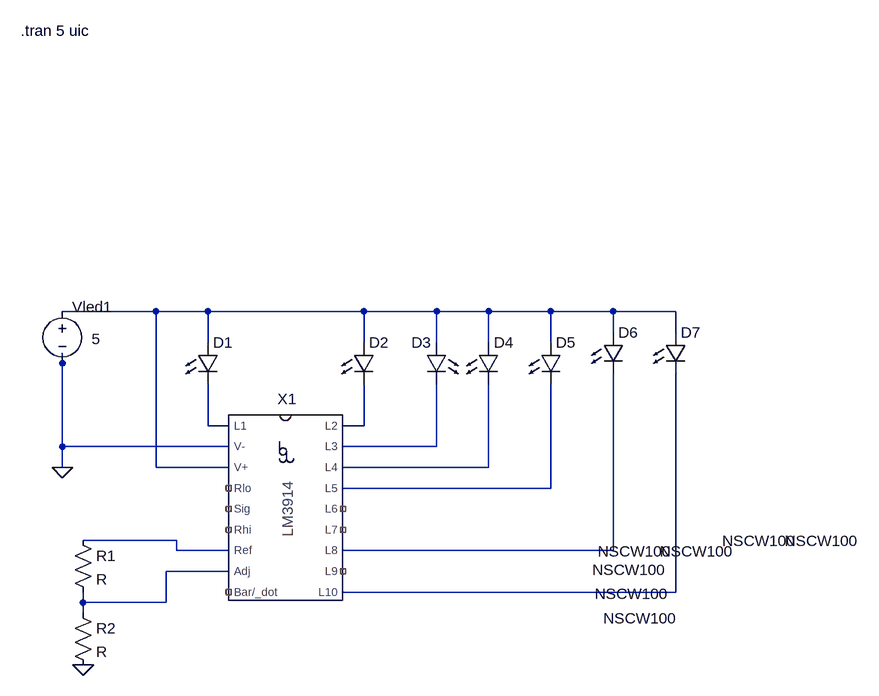
[diagram p0: schematic Draft2.asc]
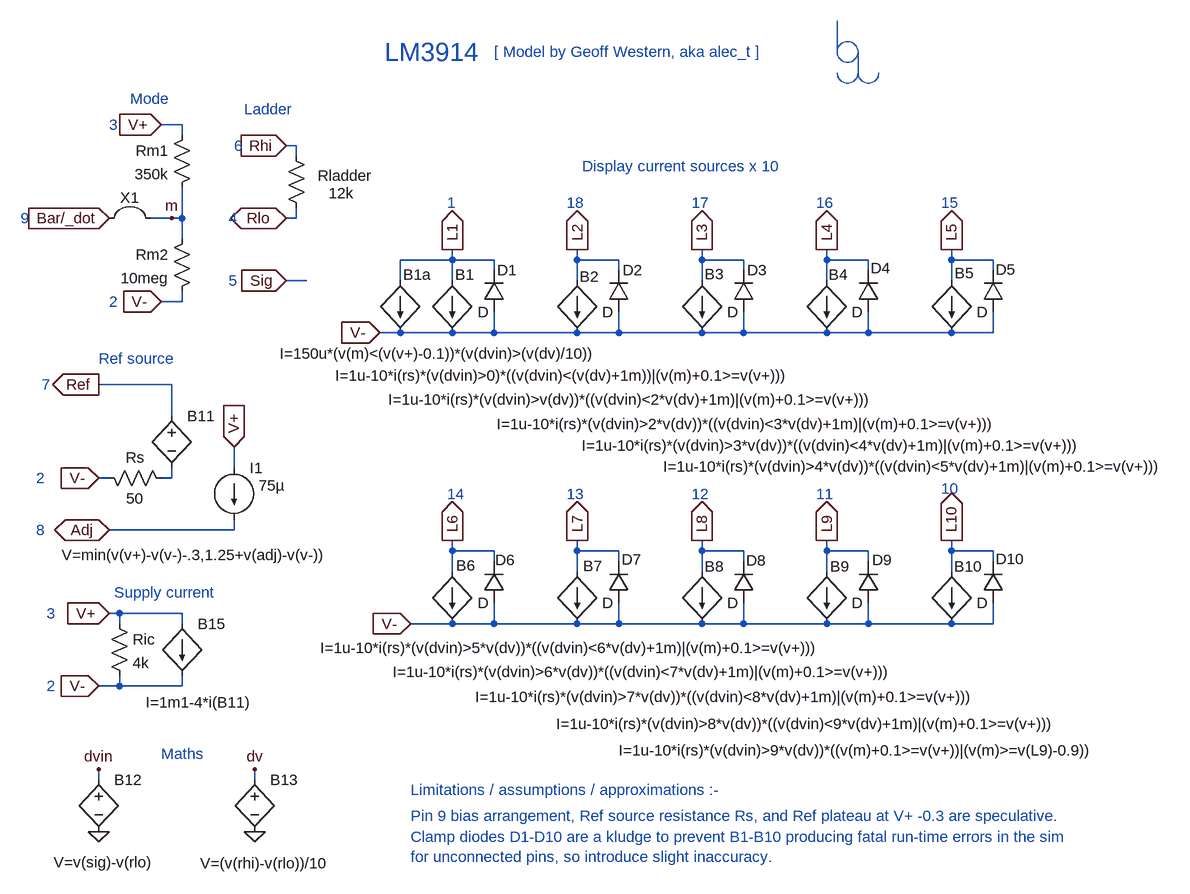
[diagram p1: sub-circuit lm3914asc.asc]
Draft2.asc, the LTspice schematic file:
Version 4
SHEET 1 880 680
WIRE -464 -1152 -608 -1152
WIRE -384 -1152 -464 -1152
WIRE -144 -1152 -384 -1152
WIRE -32 -1152 -144 -1152
WIRE 48 -1152 -32 -1152
WIRE 144 -1152 48 -1152
WIRE 240 -1152 144 -1152
WIRE 336 -1152 240 -1152
WIRE 240 -1120 240 -1152
WIRE 336 -1120 336 -1152
WIRE -384 -1104 -384 -1152
WIRE -144 -1104 -144 -1152
WIRE -32 -1104 -32 -1152
WIRE 48 -1104 48 -1152
WIRE 144 -1104 144 -1152
WIRE -608 -1072 -608 -1088
WIRE -384 -976 -384 -1040
WIRE -352 -976 -384 -976
WIRE -144 -976 -144 -1040
WIRE -144 -976 -176 -976
WIRE -608 -944 -608 -1072
WIRE -352 -944 -608 -944
WIRE -32 -944 -32 -1040
WIRE -32 -944 -176 -944
WIRE -608 -912 -608 -944
WIRE -464 -912 -464 -1152
WIRE -352 -912 -464 -912
WIRE 48 -912 48 -1040
WIRE 48 -912 -176 -912
WIRE 144 -880 144 -1040
WIRE 144 -880 -176 -880
WIRE -432 -800 -576 -800
WIRE -432 -784 -432 -800
WIRE -352 -784 -432 -784
WIRE 240 -784 240 -1056
WIRE 240 -784 -176 -784
WIRE -352 -752 -448 -752
WIRE 336 -720 336 -1056
WIRE 336 -720 -176 -720
WIRE -576 -704 -576 -720
WIRE -448 -704 -448 -752
WIRE -448 -704 -576 -704
WIRE -576 -688 -576 -704
FLAG -608 -912 0
FLAG -576 -608 0
SYMBOL LED -400 -1104 R0
WINDOW 3 612 387 Left 2
SYMATTR Value NSCW100
SYMATTR InstName D1
SYMATTR Description Diode
SYMATTR Type diode
SYMBOL LED -160 -1104 R0
WINDOW 3 385 424 Left 2
SYMATTR Value NSCW100
SYMATTR InstName D2
SYMATTR Description Diode
SYMATTR Type diode
SYMBOL LED -16 -1104 M0
WINDOW 3 -337 350 Left 2
SYMATTR Value NSCW100
SYMATTR InstName D3
SYMATTR Description Diode
SYMATTR Type diode
SYMBOL LED 32 -1104 R0
WINDOW 3 184 321 Left 2
SYMATTR Value NSCW100
SYMATTR InstName D4
SYMATTR Description Diode
SYMATTR Type diode
SYMBOL voltage -608 -1168 R0
WINDOW 123 0 0 Left 2
WINDOW 39 0 0 Left 2
WINDOW 0 15 9 Left 2
WINDOW 3 45 58 Left 2
SYMATTR InstName Vled1
SYMATTR Value 5
SYMBOL LM3914asc -272 -784 R0
SYMATTR InstName X1
SYMBOL LED 128 -1104 R0
WINDOW 3 184 321 Left 2
SYMATTR Value NSCW100
SYMATTR InstName D5
SYMATTR Description Diode
SYMATTR Type diode
SYMBOL LED 224 -1120 R0
WINDOW 3 184 321 Left 2
SYMATTR Value NSCW100
SYMATTR InstName D6
SYMATTR Description Diode
SYMATTR Type diode
SYMBOL LED 320 -1120 R0
WINDOW 3 184 321 Left 2
SYMATTR Value NSCW100
SYMATTR InstName D7
SYMATTR Description Diode
SYMATTR Type diode
SYMBOL res -592 -816 R0
SYMATTR InstName R1
SYMBOL res -592 -704 R0
SYMATTR InstName R2
TEXT -672 -1584 Left 2 !.tran 5 uic

lm3914asc.asc, the sub-circuit schematic file:
Version 4
SHEET 1 1548 1036
WIRE -528 -288 -560 -288
WIRE -528 -272 -528 -288
WIRE -352 -256 -368 -256
WIRE -352 -240 -352 -256
WIRE -544 -144 -576 -144
WIRE -528 -144 -528 -192
WIRE -528 -144 -544 -144
WIRE -352 -144 -352 -160
WIRE -352 -144 -368 -144
WIRE -528 -112 -528 -144
WIRE -112 -80 -112 -96
WIRE -112 -80 -192 -80
WIRE -48 -80 -112 -80
WIRE 80 -80 80 -96
WIRE 144 -80 80 -80
WIRE 272 -80 272 -96
WIRE 336 -80 272 -80
WIRE 464 -80 464 -96
WIRE 528 -80 464 -80
WIRE 656 -80 656 -96
WIRE 720 -80 656 -80
WIRE -48 -64 -48 -80
WIRE 144 -64 144 -80
WIRE 336 -64 336 -80
WIRE 528 -64 528 -80
WIRE 720 -64 720 -80
WIRE -336 -48 -368 -48
WIRE -192 -48 -192 -80
WIRE -112 -48 -112 -80
WIRE 80 -48 80 -80
WIRE 272 -48 272 -80
WIRE 464 -48 464 -80
WIRE 656 -48 656 -80
WIRE -528 -16 -528 -32
WIRE -528 -16 -560 -16
WIRE -192 32 -224 32
WIRE -112 32 -192 32
WIRE -48 32 -48 0
WIRE -48 32 -112 32
WIRE 80 32 -48 32
WIRE 144 32 144 0
WIRE 144 32 80 32
WIRE 272 32 144 32
WIRE 336 32 336 0
WIRE 336 32 272 32
WIRE 464 32 336 32
WIRE 528 32 528 0
WIRE 528 32 464 32
WIRE 656 32 528 32
WIRE 720 32 720 0
WIRE 720 32 656 32
WIRE -544 112 -656 112
WIRE -544 160 -544 112
WIRE -448 240 -448 208
WIRE -640 256 -656 256
WIRE -544 256 -544 240
WIRE -544 256 -560 256
WIRE -448 336 -448 320
WIRE -448 336 -640 336
WIRE -112 368 -112 352
WIRE -48 368 -112 368
WIRE 80 368 80 352
WIRE 144 368 80 368
WIRE 272 368 272 352
WIRE 336 368 272 368
WIRE 464 368 464 352
WIRE 528 368 464 368
WIRE 656 368 656 352
WIRE 720 368 656 368
WIRE -48 384 -48 368
WIRE 144 384 144 368
WIRE 336 384 336 368
WIRE 528 384 528 368
WIRE 720 384 720 368
WIRE -112 400 -112 368
WIRE 80 400 80 368
WIRE 272 400 272 368
WIRE 464 400 464 368
WIRE 656 400 656 368
WIRE -624 464 -640 464
WIRE -528 464 -624 464
WIRE -624 480 -624 464
WIRE -528 480 -528 464
WIRE -112 480 -176 480
WIRE -48 480 -48 448
WIRE -48 480 -112 480
WIRE 80 480 -48 480
WIRE 144 480 144 448
WIRE 144 480 80 480
WIRE 272 480 144 480
WIRE 336 480 336 448
WIRE 336 480 272 480
WIRE 464 480 336 480
WIRE 528 480 528 448
WIRE 528 480 464 480
WIRE 656 480 528 480
WIRE 720 480 720 448
WIRE 720 480 656 480
WIRE -624 576 -624 560
WIRE -624 576 -656 576
WIRE -528 576 -528 560
WIRE -528 576 -624 576
WIRE -656 720 -656 704
WIRE -416 720 -416 704
FLAG -368 -48 Sig
IOPIN -368 -48 In
FLAG -368 -144 Rlo
IOPIN -368 -144 BiDir
FLAG -112 -96 L1
IOPIN -112 -96 Out
FLAG -224 32 V-
IOPIN -224 32 In
FLAG 80 -96 L2
IOPIN 80 -96 Out
FLAG 272 -96 L3
IOPIN 272 -96 Out
FLAG 464 -96 L4
IOPIN 464 -96 Out
FLAG 656 -96 L5
IOPIN 656 -96 Out
FLAG -112 352 L6
IOPIN -112 352 Out
FLAG 80 352 L7
IOPIN 80 352 Out
FLAG 272 352 L8
IOPIN 272 352 Out
FLAG 464 352 L9
IOPIN 464 352 Out
FLAG 656 352 L10
IOPIN 656 352 Out
FLAG -656 112 Ref
IOPIN -656 112 Out
FLAG -368 -256 Rhi
IOPIN -368 -256 In
FLAG -640 -144 Bar/_dot
IOPIN -640 -144 In
FLAG -640 464 V+
IOPIN -640 464 In
FLAG -176 480 V-
IOPIN -176 480 In
FLAG -656 576 V-
IOPIN -656 576 In
FLAG -640 336 Adj
IOPIN -640 336 BiDir
FLAG -656 800 0
FLAG -656 704 dvin
FLAG -416 800 0
FLAG -416 704 dv
FLAG -448 208 V+
IOPIN -448 208 In
FLAG -656 256 V-
IOPIN -656 256 In
FLAG -544 -144 m
FLAG -560 -288 V+
IOPIN -560 -288 In
FLAG -560 -16 V-
IOPIN -560 -16 In
SYMBOL bi -112 -48 R0
WINDOW 3 -180 146 Left 2
WINDOW 0 4 -9 Left 2
SYMATTR Value I=1u-10*i(rs)*(v(dvin)>0)*((v(dvin)<(v(dv)+1m))|(v(m)+0.1>=v(v+)))
SYMATTR InstName B1
SYMBOL bi 80 -48 R0
WINDOW 3 -291 183 Left 2
WINDOW 0 4 -6 Left 2
SYMATTR Value I=1u-10*i(rs)*(v(dvin)>v(dv))*((v(dvin)<2*v(dv)+1m)|(v(m)+0.1>=v(v+)))
SYMATTR InstName B2
SYMBOL bi 272 -48 R0
WINDOW 3 -316 221 Left 2
WINDOW 0 4 -10 Left 2
SYMATTR Value I=1u-10*i(rs)*(v(dvin)>2*v(dv))*((v(dvin)<3*v(dv)+1m)|(v(m)+0.1>=v(v+)))
SYMATTR InstName B3
SYMBOL bi 464 -48 R0
WINDOW 3 -377 254 Left 2
WINDOW 0 3 -9 Left 2
SYMATTR Value I=1u-10*i(rs)*(v(dvin)>3*v(dv))*((v(dvin)<4*v(dv)+1m)|(v(m)+0.1>=v(v+)))
SYMATTR InstName B4
SYMBOL bi 656 -48 R0
WINDOW 3 -444 286 Left 2
WINDOW 0 5 -12 Left 2
SYMATTR Value I=1u-10*i(rs)*(v(dvin)>4*v(dv))*((v(dvin)<5*v(dv)+1m)|(v(m)+0.1>=v(v+)))
SYMATTR InstName B5
SYMBOL bi -112 400 R0
WINDOW 3 -203 117 Left 2
WINDOW 0 6 -10 Left 2
SYMATTR Value I=1u-10*i(rs)*(v(dvin)>5*v(dv))*((v(dvin)<6*v(dv)+1m)|(v(m)+0.1>=v(v+)))
SYMATTR InstName B6
SYMBOL bi 80 400 R0
WINDOW 3 -284 154 Left 2
WINDOW 0 9 -9 Left 2
SYMATTR Value I=1u-10*i(rs)*(v(dvin)>6*v(dv))*((v(dvin)<7*v(dv)+1m)|(v(m)+0.1>=v(v+)))
SYMATTR InstName B7
SYMBOL bi 272 400 R0
WINDOW 3 -349 193 Left 2
WINDOW 0 4 -8 Left 2
SYMATTR Value I=1u-10*i(rs)*(v(dvin)>7*v(dv))*((v(dvin)<8*v(dv)+1m)|(v(m)+0.1>=v(v+)))
SYMATTR InstName B8
SYMBOL bi 464 400 R0
WINDOW 3 -416 234 Left 2
WINDOW 0 5 -8 Left 2
SYMATTR Value I=1u-10*i(rs)*(v(dvin)>8*v(dv))*((v(dvin)<9*v(dv)+1m)|(v(m)+0.1>=v(v+)))
SYMATTR InstName B9
SYMBOL bi 656 400 R0
WINDOW 3 -512 275 Left 2
WINDOW 0 4 -8 Left 2
SYMATTR Value I=1u-10*i(rs)*(v(dvin)>9*v(dv))*((v(m)+0.1>=v(v+))|(v(m)>=v(L9)-0.9))
SYMATTR InstName B10
SYMBOL res -368 -256 R0
WINDOW 3 66 73 Left 2
WINDOW 0 49 46 Left 2
SYMATTR Value 12k
SYMATTR InstName Rladder
SYMBOL res -640 464 R0
SYMATTR InstName Ric
SYMATTR Value 4k
SYMBOL bv -656 704 R0
WINDOW 3 -69 143 Left 2
SYMATTR Value V=v(sig)-v(rlo)
SYMATTR InstName B12
SYMBOL bv -416 704 R0
WINDOW 3 -84 145 Left 2
SYMATTR Value V=(v(rhi)-v(rlo))/10
SYMATTR InstName B13
SYMBOL diode -32 0 R180
WINDOW 0 -20 64 Left 2
WINDOW 3 24 0 Left 2
SYMATTR InstName D1
SYMBOL diode 160 0 R180
WINDOW 0 -21 64 Left 2
WINDOW 3 24 0 Left 2
SYMATTR InstName D2
SYMBOL diode 352 0 R180
WINDOW 0 -20 64 Left 2
WINDOW 3 24 0 Left 2
SYMATTR InstName D3
SYMBOL diode 544 0 R180
WINDOW 0 -18 67 Left 2
WINDOW 3 24 0 Left 2
SYMATTR InstName D4
SYMBOL diode 736 0 R180
WINDOW 0 -19 65 Left 2
WINDOW 3 24 0 Left 2
SYMATTR InstName D5
SYMBOL diode -32 448 R180
WINDOW 0 -17 66 Left 2
WINDOW 3 24 0 Left 2
SYMATTR InstName D6
SYMBOL diode 160 448 R180
WINDOW 0 -19 67 Left 2
WINDOW 3 24 0 Left 2
SYMATTR InstName D7
SYMBOL diode 352 448 R180
WINDOW 0 -19 65 Left 2
WINDOW 3 24 0 Left 2
SYMATTR InstName D8
SYMBOL diode 544 448 R180
WINDOW 0 -21 66 Left 2
WINDOW 3 24 0 Left 2
SYMATTR InstName D9
SYMBOL diode 736 448 R180
WINDOW 0 -32 68 Left 2
WINDOW 3 24 0 Left 2
SYMATTR InstName D10
SYMBOL res -512 -128 M0
SYMATTR InstName Rm2
SYMATTR Value 10meg
SYMBOL current -448 240 R0
WINDOW 123 0 0 Left 2
WINDOW 39 0 0 Left 2
WINDOW 3 38 27 Left 2
SYMATTR Value 75µ
SYMATTR InstName I1
SYMBOL res -544 272 M270
WINDOW 3 0 56 VBottom 2
WINDOW 0 32 56 VTop 2
SYMATTR Value 50
SYMATTR InstName Rs
SYMBOL bv -544 144 R0
WINDOW 3 -169 230 Left 2
SYMATTR Value V=min(v(v+)-v(v-)-.3,1.25+v(adj)-v(v-))
SYMATTR InstName B11
SYMBOL bi -192 -48 R0
WINDOW 3 -186 112 Left 2
WINDOW 0 4 -9 Left 2
SYMATTR Value I=150u*(v(m)<(v(v+)-0.1))*(v(dvin)>(v(dv)/10))
SYMATTR InstName B1a
SYMBOL bi -528 480 R0
WINDOW 3 -56 121 Left 2
SYMATTR Value I=1m1-4*i(B11)
SYMATTR InstName B15
SYMBOL res -512 -288 M0
SYMATTR InstName Rm1
SYMATTR Value 350k
SYMBOL Misc\\jumper -608 -208 R0
SYMATTR InstName X1
TEXT -736 464 Left 2 ;3
TEXT -776 -144 Left 2 ;9
TEXT -456 -48 Left 2 ;5
TEXT -744 112 Left 2 ;7
TEXT -448 -256 Left 2 ;6
TEXT -752 336 Left 2 ;8
TEXT -456 -144 Left 2 ;4
TEXT -216 -400 Left 4 ;LM3914
TEXT -120 -168 Left 2 ;1
TEXT 64 -168 Left 2 ;18
TEXT 256 -168 Left 2 ;17
TEXT 448 -168 Left 2 ;16
TEXT 640 -168 Left 2 ;15
TEXT -120 280 Left 2 ;14
TEXT 64 280 Left 2 ;13
TEXT 256 280 Left 2 ;12
TEXT 448 280 Left 2 ;11
TEXT 640 272 Left 2 ;10
TEXT -176 808 Left 2 ;Clamp diodes D1-D10 are a kludge to prevent B1-B10 producing fatal run-time errors in the sim\nfor unconnected pins, so introduce slight inaccuracy.
TEXT -632 432 Left 2 ;Supply current
TEXT -736 576 Left 2 ;2
TEXT -176 736 Left 2 ;Limitations / assumptions / approximations :-
TEXT -752 256 Left 2 ;2
TEXT -176 776 Left 2 ;Pin 9 bias arrangement, Ref source resistance Rs, and Ref plateau at V+ -0.3 are speculative.
TEXT -48 -400 Left 2 ;[ Model by Geoff Western, aka alec_t ]
TEXT -656 72 Left 2 ;Ref source
TEXT -560 680 Left 2 ;Maths
TEXT -608 -328 Left 2 ;Mode
TEXT -432 -312 Left 2 ;Ladder
TEXT 88 -224 Left 2 ;Display current sources x 10
TEXT -640 -16 Left 2 ;2
TEXT -640 -288 Left 2 ;3
LINE Normal 480 -448 480 -416
LINE Normal 480 -432 480 -400
LINE Normal 512 -400 512 -368
CIRCLE Normal 512 -384 480 -416
ARC Normal 480 -384 512 -352 482 -368 518 -368
ARC Normal 512 -384 544 -352 514 -368 550 -368

The netlist it stands for:
* Draft2.asc
D1 N001 N002 NSCW100
D2 N001 N003 NSCW100
D3 N001 N004 NSCW100
D4 N001 N005 NSCW100
Vled1 N001 0 5
XX1 NC_01 NC_02 NC_03 N001 0 N009 N002 N010 N003 N004 N005 N006 NC_04 NC_05 N008 NC_06 N007 NC_07 lm3914asc
D5 N001 N006 NSCW100
D6 N001 N008 NSCW100
D7 N001 N010 NSCW100
R1 N007 N009 R
R2 N009 0 R

* block symbol definitions
.subckt lm3914asc Bar/_dot Sig Rhi V+ V- Adj L1 L10 L2 L3 L4 L5 L6 L7 L8 L9 Ref Rlo
B1 L1 V- I=1u-10*i(rs)*(v(dvin)>0)*((v(dvin)<(v(dv)+1m))|(v(m)+0.1>=v(v+)))
B2 L2 V- I=1u-10*i(rs)*(v(dvin)>v(dv))*((v(dvin)<2*v(dv)+1m)|(v(m)+0.1>=v(v+)))
B3 L3 V- I=1u-10*i(rs)*(v(dvin)>2*v(dv))*((v(dvin)<3*v(dv)+1m)|(v(m)+0.1>=v(v+)))
B4 L4 V- I=1u-10*i(rs)*(v(dvin)>3*v(dv))*((v(dvin)<4*v(dv)+1m)|(v(m)+0.1>=v(v+)))
B5 L5 V- I=1u-10*i(rs)*(v(dvin)>4*v(dv))*((v(dvin)<5*v(dv)+1m)|(v(m)+0.1>=v(v+)))
B6 L6 V- I=1u-10*i(rs)*(v(dvin)>5*v(dv))*((v(dvin)<6*v(dv)+1m)|(v(m)+0.1>=v(v+)))
B7 L7 V- I=1u-10*i(rs)*(v(dvin)>6*v(dv))*((v(dvin)<7*v(dv)+1m)|(v(m)+0.1>=v(v+)))
B8 L8 V- I=1u-10*i(rs)*(v(dvin)>7*v(dv))*((v(dvin)<8*v(dv)+1m)|(v(m)+0.1>=v(v+)))
B9 L9 V- I=1u-10*i(rs)*(v(dvin)>8*v(dv))*((v(dvin)<9*v(dv)+1m)|(v(m)+0.1>=v(v+)))
B10 L10 V- I=1u-10*i(rs)*(v(dvin)>9*v(dv))*((v(m)+0.1>=v(v+))|(v(m)>=v(L9)-0.9))
Rladder Rhi Rlo 12k
Ric V+ V- 4k
B12 dvin 0 V=v(sig)-v(rlo)
B13 dv 0 V=(v(rhi)-v(rlo))/10
D1 V- L1 D
D2 V- L2 D
D3 V- L3 D
D4 V- L4 D
D5 V- L5 D
D6 V- L6 D
D7 V- L7 D
D8 V- L8 D
D9 V- L9 D
D10 V- L10 D
Rm2 Bar/_dot V- 10meg
I1 V+ Adj 75µ
Rs N001 V- 50
B11 Ref N001 V=min(v(v+)-v(v-)-.3,1.25+v(adj)-v(v-))
B1a L1 V- I=150u*(v(m)<(v(v+)-0.1))*(v(dvin)>(v(dv)/10))
B15 V+ V- I=1m1-4*i(B11)
Rm1 V+ Bar/_dot 350k
* 3
* 9
* 5
* 7
* 6
* 8
* 4
* LM3914
* 1
* 18
* 17
* 16
* 15
* 14
* 13
* 12
* 11
* 10
* Clamp diodes D1-D10 are a kludge to prevent B1-B10 producing fatal run-time errors in the sim
* for unconnected pins, so introduce slight inaccuracy.
* Supply current
* 2
* Limitations / assumptions / approximations :-
* 2
* Pin 9 bias arrangement, Ref source resistance Rs, and Ref plateau at V+ -0.3 are speculative.
* [ Model by Geoff Western, aka alec_t ]
* Ref source
* Maths
* Mode
* Ladder
* Display current sources x 10
* 2
* 3
.ends lm3914asc

.model D D
.lib standard.dio
.tran 5 uic
.backanno
.end